# EAGLE schematic esquematico_placa (EAGLE 9.4.2)
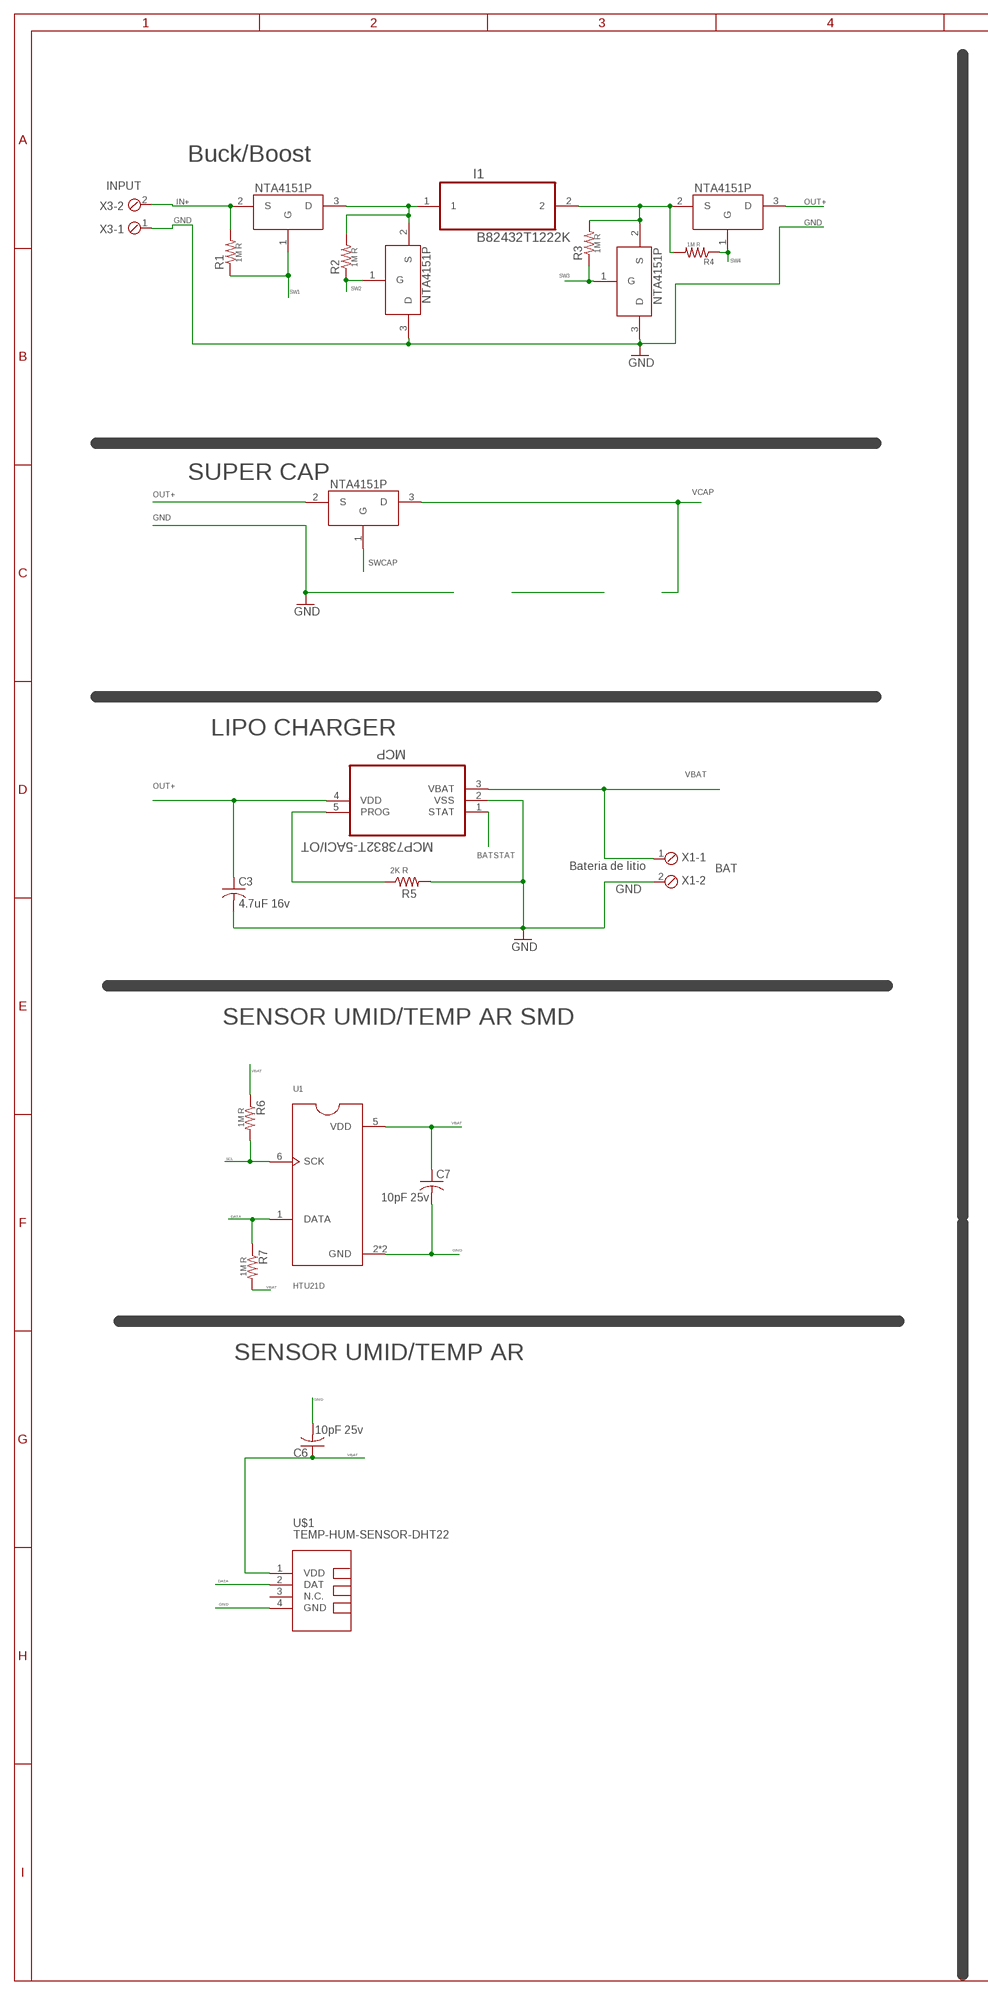
[diagram p0: schematic, sheet 1, part 1 of 2]
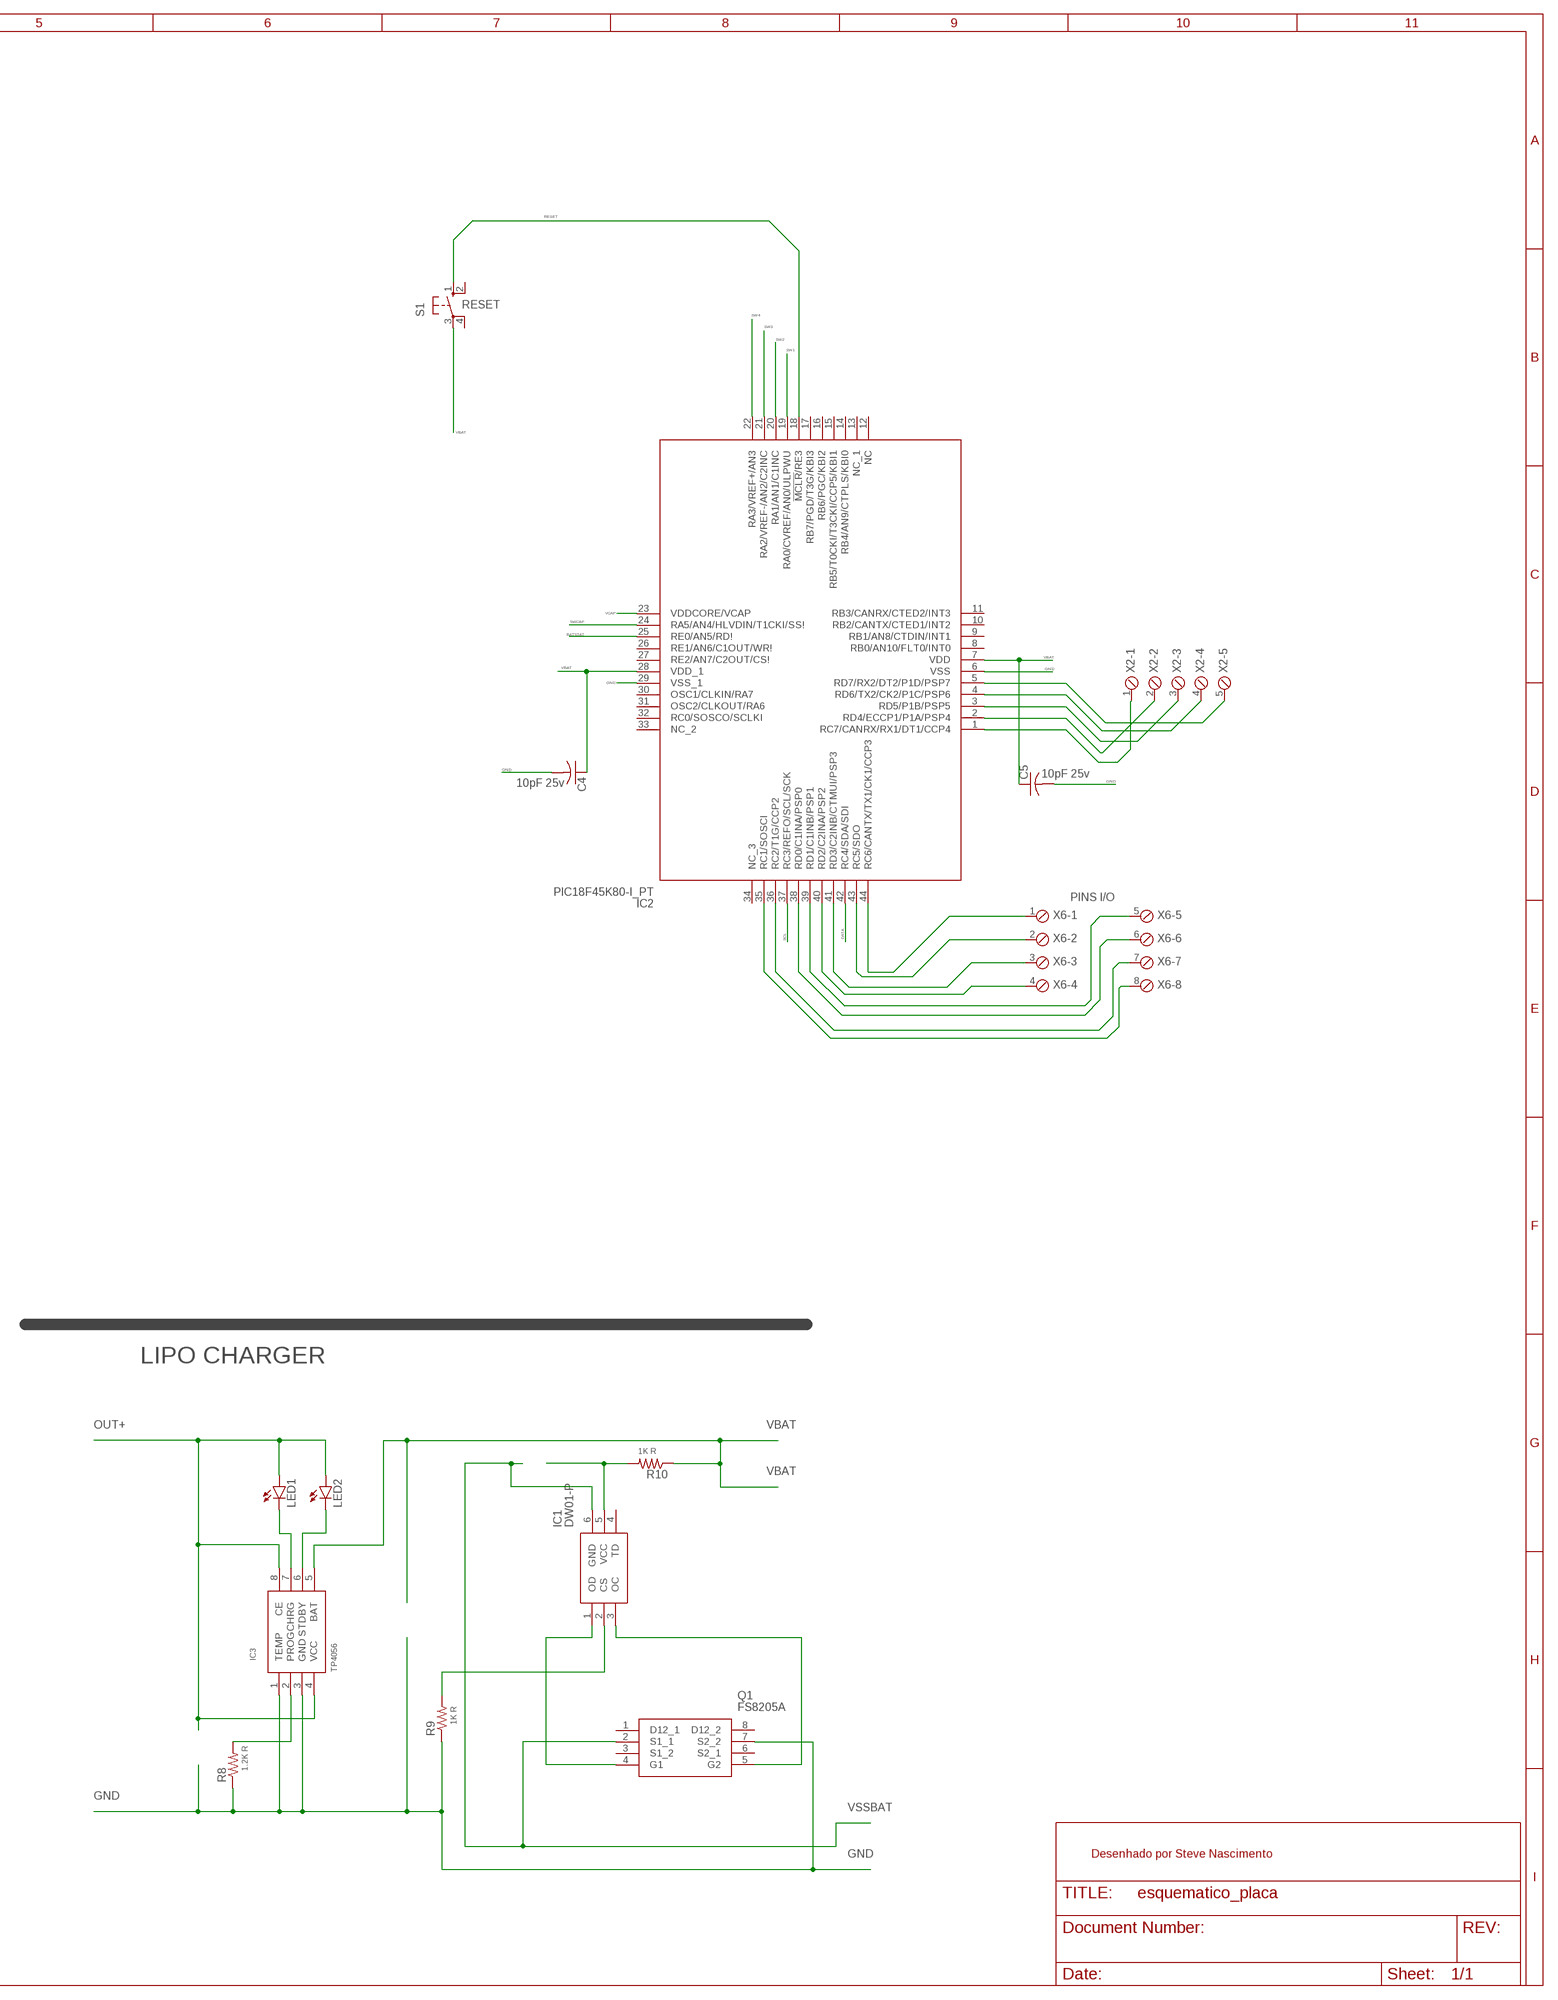
[diagram p1: schematic, sheet 1, part 2 of 2]

## Parts
C3  4.7uF 16v  C-USC0805  [C0805]
C4  10pF 25v  C-USC0805  [C0805]
C5  10pF 25v  C-USC0805  [C0805]
C6  10pF 25v  C-USC0805  [C0805]
C7  10pF 25v  C-USC0805  [C0805]
I1  B82432T1222K  [INDC4532X340N]
IC1  DW01-P  [SOT95P280X135-6N]
IC2  PIC18F45K80-I_PT  [QFP80P1200X1200X120-44N]
IC3  TP4056  [SOP-8]
LED1  LED5MM  [LED5MM]
LED2  LED5MM  [LED5MM]
M1  NTA4151P  [SOT50P160X90-3N]
M2  NTA4151P  [SOT50P160X90-3N]
M3  NTA4151P  [SOT50P160X90-3N]
M4  NTA4151P  [SOT50P160X90-3N]
MCP  MCP73832T-5ACI/OT  [SOT95P300X145-5N]
Q1  FS8205A  [SOP65P640X120-8N]
R1  1M R  CRGH0805F392R  [RESC2012X65N]
R2  1M R  CRGH0805F392R  [RESC2012X65N]
R3  1M R  CRGH0805F392R  [RESC2012X65N]
R4  1M R  CRGH0805F392R  [RESC2012X65N]
R5  2K R  CRGH0805F392R  [RESC2012X65N]
R6  1M R  CRGH0805F392R  [RESC2012X65N]
R7  1M R  CRGH0805F392R  [RESC2012X65N]
R8  1.2K R  CRGH0805F392R  [RESC2012X65N]
R9  1K R  CRGH0805F392R  [RESC2012X65N]
R10  1K R  CRGH0805F392R  [RESC2012X65N]
S1  RESET  10-XX  [B3F-10XX]
SC  NTA4151P  [SOT50P160X90-3N]
U1  HTU21D  [QFN100P300X300X100-7N]
U$1  TEMP-HUM-SENSOR-DHT22  [TEMP-HUM-SENSOR-DHT22]
X1  BAT  MPT2  [2POL254]
X2  MPT5  [5POL254]
X3  INPUT  MPT2  [2POL254]
X6  PINS I/O  MPT8  [8POL254]

## Nets
BATSTAT: IC2.25(RE0/AN5/RD!) MCP.1(STAT)
DATA: IC2.42(RC4/SDA/SDI) R7.1 U1.1(DATA) U$1.2(DAT)
GND: C3.2 C4.2 C5.2 C6.2 C7.2 IC2.6(VSS) IC2.29(VSS_1) IC3.1(TEMP) IC3.3(GND) M2.3(D) M3.3(D) MCP.2(VSS) Q1.7(S2_2) R5.2 R8.1 R9.1 U1.2(GND) U1.PAD(GND) U$1.4(GND) X1.2 X3.1
IN+: M1.2(S) R1.2 X3.2
N$1: I1.1 M1.3(D) M2.2(S) R2.2
N$2: I1.2 M3.2(S) M4.2(S) R3.2 R4.2
N$4: MCP.5(PROG) R5.1
N$6: IC3.7(CHRG) LED1.K(C)
N$7: IC3.6(STDBY) LED2.K(C)
N$10: IC3.2(PROG) R8.2
N$12: IC1.5(VCC) R10.2
N$14: IC2.35(RC1/SOSCI) X6.8
N$15: IC1.2(CS) R9.2
N$16: IC1.3(OC) Q1.5(G2)
N$17: IC2.38(RD0/C1INA/PSP0) X6.6
N$18: IC2.39(RD1/C1INB/PSP1) X6.5
N$19: IC2.40(RD2/C2INA/PSP2) X6.4
N$20: IC2.41(RD3/C2INB/CTMUI/PSP3) X6.3
N$21: IC1.1(OD) Q1.4(G1)
N$22: IC2.43(RC5/SDO) X6.2
N$23: IC2.44(RC6/CANTX/TX1/CK1/CCP3) X6.1
N$24: IC2.36(RC2/T1G/CCP2) X6.7
N$31: IC2.5(RD7/RX2/DT2/P1D/PSP7) X2.5
N$32: IC2.4(RD6/TX2/CK2/P1C/PSP6) X2.4
N$33: IC2.3(RD5/P1B/PSP5) X2.3
N$34: IC2.2(RD4/ECCP1/P1A/PSP4) X2.2
N$35: IC2.1(RC7/CANRX/RX1/DT1/CCP4) X2.1
OUT+: C3.1 IC3.4(VCC) IC3.8(CE) LED1.A LED2.A M4.3(D) MCP.4(VDD) SC.2(S)
RESET: IC2.18(!MCLR!/RE3) S1.1(S)
SCL: IC2.37(RC3/REFO/SCL/SCK) R6.2 U1.6(SCK)
SW1: IC2.19(RA0/CVREF/AN0/ULPWU) M1.1(G) R1.1
SW2: IC2.20(RA1/AN1/C1INC) M2.1(G) R2.1
SW3: IC2.21(RA2/VREF-/AN2/C2INC) M3.1(G) R3.1
SW4: IC2.22(RA3/VREF+/AN3) M4.1(G) R4.1
SWCAP: IC2.24(RA5/AN4/HLVDIN/T1CKI/SS!) SC.1(G)
VBAT: C4.1 C5.1 C6.1 C7.1 IC2.7(VDD) IC2.28(VDD_1) IC3.5(BAT) MCP.3(VBAT) R6.1 R7.2 R10.1 S1.3(P) U1.5(VDD) U$1.1(VDD) X1.1
VCAP: IC2.23(VDDCORE/VCAP) SC.3(D)
VSSBAT: IC1.6(GND) Q1.2(S1_1)
Unconnected: IC1.4(TD) IC2.8(RB0/AN10/FLT0/INT0) IC2.9(RB1/AN8/CTDIN/INT1) IC2.10(RB2/CANTX/CTED1/INT2) IC2.11(RB3/CANRX/CTED2/INT3) IC2.12(NC) IC2.13(NC_1) IC2.14(RB4/AN9/CTPLS/KBI0) IC2.15(RB5/T0CKI/T3CKI/CCP5/KBI1) IC2.16(RB6/PGC/KBI2) IC2.17(RB7/PGD/T3G/KBI3) IC2.26(RE1/AN6/C1OUT/WR!) IC2.27(RE2/AN7/C2OUT/CS!) IC2.30(OSC1/CLKIN/RA7) IC2.31(OSC2/CLKOUT/RA6) IC2.32(RC0/SOSCO/SCLKI) IC2.33(NC_2) IC2.34(NC_3) Q1.1(D12_1) Q1.3(S1_2) Q1.6(S2_1) Q1.8(D12_2) S1.2(S1) S1.4(P1) U$1.3(N.C.)

## Notes on the sheet
- Buck/Boost
- SUPER CAP
- LIPO CHARGER
- Bateria de litio
- SENSOR UMID/TEMP AR SMD
- SENSOR UMID/TEMP AR | LIPO CHARGER
- Desenhado por Steve Nascimento

## Library data of the parts
C3-C7 = rcl:C-US: CAPACITOR, American symbol; SPICEPREFIX: C
I1 = B82432T1222K:B82432T1222K: SMT inductors; AVAILABILITY: Unavailable; DESCRIPTION: Ind Chip Molded Wirewound 2.2uH 10% 7.96MHz 10Q-Factor Ferrite 1A 1812 Blister T/R; MF: EPCOS; MP: B82432T1222K; PACKAGE: 1812 EPCOS; PRICE: None
IC1 = DW01-P:DW01-P: hg Source: Datasheet <https://cdn.sparkfun.com/assets/learn_tutorials/2/5/1/DW01-P_DataSheet_V10.pdf>; DESCRIPTION: hg; HEIGHT: 1.35mm; MANUFACTURER_NAME: Fortune Semiconductor Corporation; MANUFACTURER_PART_NUMBER: DW01-P
IC2 = PIC18F45K80-I_PT:PIC18F45K80-I_PT: MCU, 32kB Flash, ECAN, 12-bit ADC, CTMU Source: Datasheet <http://docs-emea.rs-online.com/webdocs/0f3b/0900766b80f3b175.pdf>; ALLIED_NUMBER: 70047564; ALLIED_PRICE-STOCK: http://www.alliedelec.com/microchip-technology-inc-pic18f45k80-i-pt/70047564/; DESCRIPTION: MCU, 32kB Flash, ECAN, 12-bit ADC, CTMU; HEIGHT: 1.2mm; MANUFACTURER_NAME: Microchip; MANUFACTURER_PART_NUMBER: PIC18F45K80-I/PT; MOUSER_PART_NUMBER: 579-PIC18F45K80-I/PT; MOUSER_PRICE-STOCK: https://www.mouser.com/Search/Refine.aspx?Keyword=579-PIC18F45K80-I%2FPT; RS_PART_NUMBER: 8895477; RS_PRICE-STOCK: http://uk.rs-online.com/web/p/products/8895477
IC3 = TP4056:TP4056
LED1 LED2 = led:LED: LED OSRAM: - CHIPLED LG R971, LG N971, LY N971, LG Q971, LY Q971, LO R971, LY R971 LH N974, LH R974 LS Q976, LO Q976, LY Q976 LO Q996 - Hyper CHIPLED LW Q18S LB Q993, LB Q99A, LB R99A - SideLED LS A670, LO A670, LY A670, LG A670, LP A670 LB A673, LV A673, LT A673, LW A673 LH A674 LY A675 LS A676, LA A676, LO A676, LY A676, LW A676 LS A679, LY A679, LG A679 - Hyper Micro SIDELED® LS Y876, LA Y876, LO Y876, LY Y876 LT Y87S - SmartLED LW L88C, LW L88S LB L89C, LB L89S, LG L890 LS L89K, LO L89K, LY L89K LS L896, LA L896, LO L896, LY L896 - TOPLED LS T670, LO T670, LY T670, LG T670, LP T670 LSG T670, LSP T670, LSY T670, LOP T670, LYG T670 LG T671, LOG T671, LSG T671 LB T673, LV T673, LT T673, LW T673 LH T674 LS T676, LA T676, LO T676, LY T676, LB T676, LH T676, LSB T676, LW T676 LB T67C, LV T67C, LT T67C, LS T67K, LO T67K, LY T67K, LW E67C LS E67B, LA E67B, LO E67B, LY E67B, LB E67C, LV E67C, LT E67C LW T67C LS T679, LY T679, LG T679 LS T770, LO T770, LY T770, LG T770, LP T770 LB T773, LV T773, LT T773, LW T773 LH T774 LS E675, LA E675, LY E675, LS T675 LS T776, LA T776, LO T776, LY T776, LB T776 LHGB T686 LT T68C, LB T68C - Hyper Mini TOPLED® LB M676 - Mini TOPLED Santana® LG M470 LS M47K, LO M47K, LY M47K Source: http://www.osram.convergy.de LUXEON: - LUMILED® LXK2-PW12-R00, LXK2-PW12-S00, LXK2-PW14-U00, LXK2-PW14-V00 LXK2-PM12-R00, LXK2-PM12-S00, LXK2-PM14-U00 LXK2-PE12-Q00, LXK2-PE12-R00, LXK2-PE12-S00, LXK2-PE14-T00, LXK2-PE14-U00 LXK2-PB12-K00, LXK2-PB12-L00, LXK2-PB12-M00, LXK2-PB14-N00, LXK2-PB14-P00, LXK2-PB14-Q00 LXK2-PR12-L00, LXK2-PR12-M00, LXK2-PR14-Q00, LXK2-PR14-R00 LXK2-PD12-Q00, LXK2-PD12-R00, LXK2-PD12-S00 LXK2-PH12-R00, LXK2-PH12-S00 LXK2-PL12-P00, LXK2-PL12-Q00, LXK2-PL12-R00 Source: www.luxeon.com KINGBRIGHT: KA-3528ASYC Source: www.kingbright.com
M1-M4 SC = nta4151p:NTA4151P: NTA4151P Small Signal MOSFET −20 V, −760 mA, Single P−Channel, Gate Zener, SC−75, SC−89
MCP = MCP73832T-5ACI_OT:MCP73832T-5ACI/OT: IC, BATT CHARGER, Li-Ion Li-Polymer, 500 mA; AVAILABILITY: Unavailable; DESCRIPTION: Tiny Integrated Li-Ion/Li-Poly Charge mgnt controller, 4.5V Vreg out; MF: Microchip; MP: MCP73832T-5ACI/OT; PACKAGE: SOT-23 Microchip; PRICE: None
Q1 = FS8205A:FS8205A: dual n-channel enhancement mode power MOFSET Source: Datasheet <http://www.ic-fortune.com/upload/Download/FS8205A-DS-12_EN.pdf>; DESCRIPTION: dual n-channel enhancement mode power MOFSET; HEIGHT: 1.2mm; MANUFACTURER_NAME: SII Semiconductor; MANUFACTURER_PART_NUMBER: FS8205A
R1-R10 = 0805 Resistor:CRGH0805F392R: RES SMD 392 OHM 1% 1/3W 0805; AVAILABILITY: Unavailable; COMMENT: 5-1879509-5; DESCRIPTION: Res Thick Film 0805 392 Ohm 1% 1/3W ±100ppm/°C Molded SMD SMD T/R; MF: TE Connectivity; MP: CRGH0805F392R; PACKAGE: 0805 TE Connectivity; PRICE: None; TE_PURCHASE_URL: https://www.te.com/usa-en/product-5-1879509-5.html?te_bu=Cor&te_type=disp&te_campaign=seda_glo_cor-seda-global-disp-prtnr-fy19-seda-model-bom-cta_sma-317_1&elqCampaignId=32493
S1 = switch-omron:10-XX: OMRON SWITCH; MPN: B3F-1000; OC_FARNELL: 176432; OC_NEWARK: 36M3542
U1 = HTU21D:HTU21D: Digital Relative Humidity sensor with Temperature output; AVAILABILITY: Unavailable; COMMENT: CAT-HSC0004; DESCRIPTION: Temp Sensor Digital Serial _2-Wire, I2C_ 6-Pin DFN; MF: TE Connectivity; MP: HTU21D; PACKAGE: DFN-6 Measurement Specialties; PRICE: None; TE_PURCHASE_URL: https://www.te.com/usa-en/product-CAT-HSC0004.html?te_bu=Cor&te_type=disp&te_campaign=seda_glo_cor-seda-global-disp-prtnr-fy19-seda-model-bom-cta_sma-317_1&elqCampaignId=32493
U$1 = diy-modules:TEMP-HUM-SENSOR-DHT22: DHT22 - digital humidity & temperature sensor Also known as: AM2302 AM2302 datasheet available here: http://akizukidenshi.com/download/ds/aosong/AM2302.pdf Click here to find device on ebay.com <http://www.ebay.com/sch/dht22+digital+sensor>
X1 X3 = con-phoenix-254:MPT2: PHOENIX CONNECTOR; OC_FARNELL: unknown; OC_NEWARK: unknown
X2 = con-phoenix-254:MPT5: PHOENIX CONNECTOR; OC_FARNELL: unknown; OC_NEWARK: unknown
X6 = con-phoenix-254:MPT8: PHOENIX CONNECTOR; OC_FARNELL: unknown; OC_NEWARK: unknown